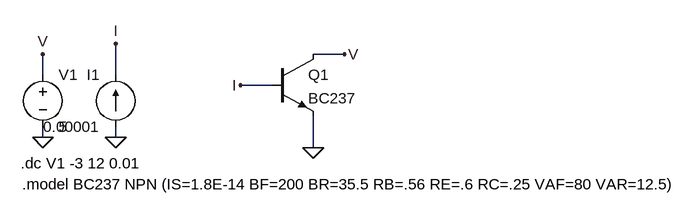
[diagram p0: schematic prelab3_1.asc]
prelab3_1.asc, the LTspice schematic file:
Version 4
SHEET 1 968 680
WIRE 384 96 336 96
WIRE -80 128 -80 96
WIRE 32 128 32 80
WIRE 272 144 224 144
WIRE -80 224 -80 208
WIRE 32 224 32 208
WIRE 336 240 336 192
FLAG 336 240 0
FLAG 32 224 0
FLAG -80 224 0
FLAG -80 96 V
FLAG 32 80 I
FLAG 224 144 I
FLAG 384 96 V
SYMBOL voltage -80 112 R0
WINDOW 123 0 0 Left 0
WINDOW 39 0 0 Left 0
SYMATTR InstName V1
SYMATTR Value 5
SYMBOL current 32 208 R180
WINDOW 0 24 80 Left 2
WINDOW 3 24 0 Left 2
WINDOW 123 0 0 Left 0
WINDOW 39 0 0 Left 0
SYMATTR InstName I1
SYMATTR Value 0.00001
SYMBOL npn 272 96 R0
SYMATTR InstName Q1
SYMATTR Value BC237
TEXT -114 264 Left 2 !.dc V1 -3 12 0.01
TEXT -112 296 Left 2 !.model BC237 NPN (IS=1.8E-14 BF=200 BR=35.5 RB=.56 RE=.6 RC=.25 VAF=80 VAR=12.5)

The netlist it stands for:
* prelab3_1.asc
V1 V 0 5
I1 0 I 0.00001
Q1 V I 0 0 BC237
.model NPN NPN
.model PNP PNP
.lib standard.bjt
.dc V1 -3 12 0.01
.model BC237 NPN (IS=1.8E-14 BF=200 BR=35.5 RB=.56 RE=.6 RC=.25 VAF=80 VAR=12.5)
.backanno
.end